# Altium schematic sheet СБ_template.SchDoc
size 840 x 594 mm; Address1: Address1; Address2: Address2; Address3: Address3; Address4: Address4; SheetNumber: 1; Scale: 1:1; Разраб.: Иванов; Обозначение документа: АБВГ.123456.001 Э3; Пров.: Петров; Утв.: Сидоров; Наименование организации: ОАО "Концерн "МПО-Гидроприбор"; Перв. применение: АБВГ.123456.000; Наименование изделия 1: Плата; Наименование изделия 2: Схема электрическая; Наименование изделия 3: принципиальная; Нач. отд.: Нач. отд.; Фамилия нач. отд.: Сидоров
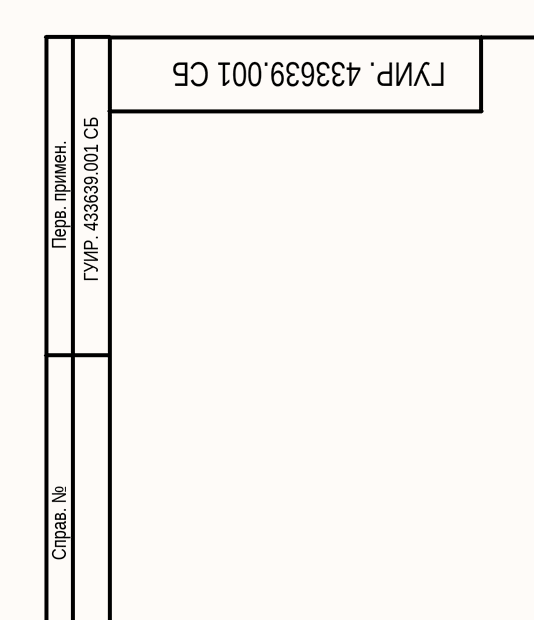
[diagram p0: СБ_template.SchDoc, top left]
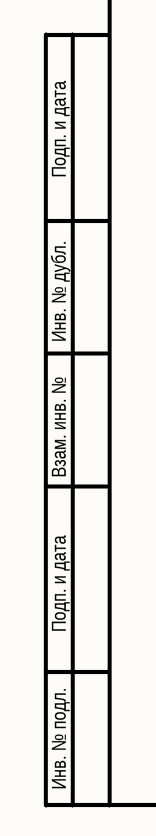
[diagram p1: СБ_template.SchDoc, bottom left]
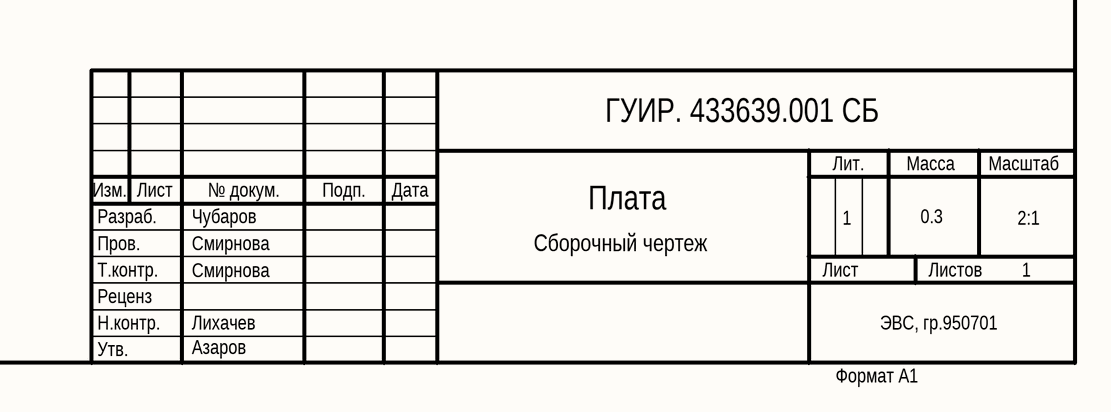
[diagram p2: СБ_template.SchDoc, bottom right]

## Notes on the sheet
- ГУИР. 433639.001 СБ
- Перв. примен.
- Справ. №
- Подп. и дата
- Инв. № дубл.
- Взам. инв. №
- Разраб.
- Изм.
- Лист
- Чубаров
- № докум.
- Подп.
- Дата
- Плата
- 1
- Лит.
- Масса
- 0.3
- 2:1
- Масштаб
- Пров.
- Т.контр.
- Смирнова
- Сборочный чертеж
- Листов
- Инв. № подл.
- Утв.
- Н.контр.
- Реценз
- Лихачев
- Азаров
- ЭВС, гр.950701
- Формат А1